# EAGLE schematic Placa 1 (EAGLE 7.2.0)
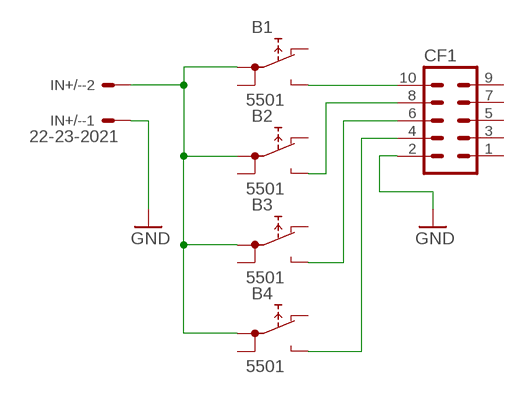
[diagram p0: schematic, sheet 1]

## Parts
B1  5501  [5501]
B2  5501  [5501]
B3  5501  [5501]
B4  5501  [5501]
CF1  ML10  [ML10]
IN+/-  22-23-2021  [22-23-2021]

## Nets
GND: CF1.2 IN+/-.1
N$1: B1.1A B2.1A B3.1A B4.1A IN+/-.2
N$4: B1.NO CF1.10
N$5: B2.NO CF1.8
N$6: B3.NO CF1.6
N$7: B4.NO CF1.4
Unconnected: B1.1B B1.NC B2.1B B2.NC B3.1B B3.NC B4.1B B4.NC CF1.1 CF1.3 CF1.5 CF1.7 CF1.9

## Library data of the parts
B1-B4 = switch:55?: PUSHBUTTON SERIES 5500 SWITCHES Source: www.e-switch.com .. 5500.pdf
CF1 = con-ml:ML10: HARTING; OC_FARNELL: unknown; OC_NEWARK: unknown
IN+/- = con-molex:22-23-2021: .100" (2.54mm) Center Header - 2 Pin; MF: MOLEX; MPN: 22-23-2021; OC_FARNELL: 1462926; OC_NEWARK: 25C3832